# Altium project USB HUB.PrjPcb
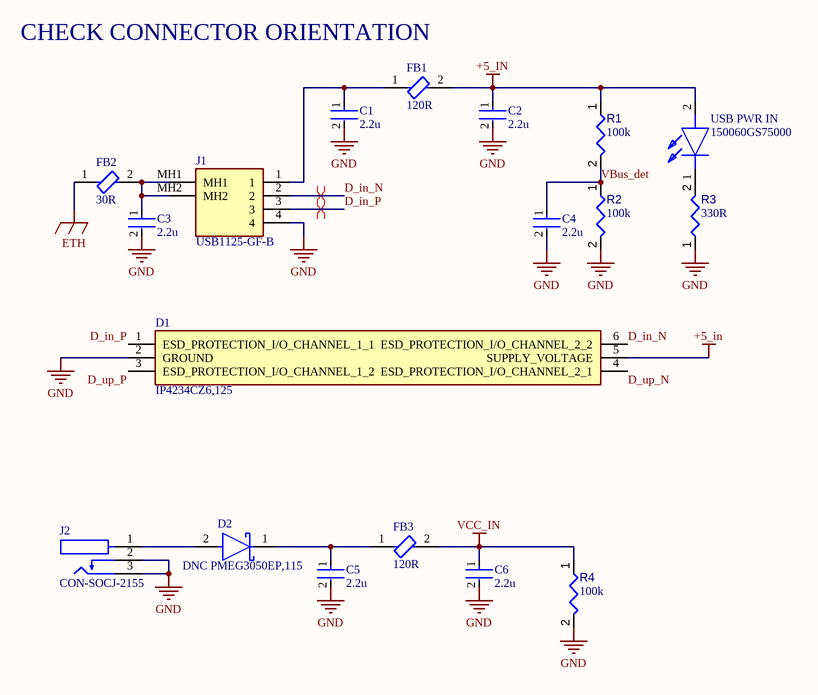
[diagram p0: Inputs.SchDoc]
4 sheets, 153 parts. Net scope: global (net labels, ports and power ports of the same name join across sheets).
Board file: USB_HUB.PcbDoc
Sheets:
  Inputs.SchDoc
  Power.SchDoc
  USB_HUB.SchDoc
  Outputs.SchDoc

## Sheet Inputs.SchDoc
size A4; SheetNumber: 1; SheetTotal: 4

### Parts
C1  Capacitance: 2.2u  [0603-C]  (hidden comment: 0603 CAP)
C2  Capacitance: 2.2u  [0603-C]  (hidden comment: 0603 CAP)
C3  Capacitance: 2.2u  [0603-C]  (hidden comment: 0603 CAP)
C4  Capacitance: 2.2u  [0603-C]  (hidden comment: 0603 CAP)
C5  Capacitance: 2.2u  [0603-C]  (hidden comment: 0603 CAP)
C6  Capacitance: 2.2u  [0603-C]  (hidden comment: 0603 CAP)
D1  IP4234CZ6,125  [SOP95P275X110-6N]
D2  DNC PMEG3050EP,115  [FP-SOD128-MFG]
FB1  120R  [FP-ILHB-0805-IPC_C]
FB2  30R  [FP-BLM18-0_15-t0_6-d1_2-MFG]
FB3  120R  [FP-ILHB-0805-IPC_C]
J1  USB1125-GF-B  [USB1125GFB]
J2  CON-SOCJ-2155  [GRAVITECH_CON-SOCJ-2155]
R1  value 100k  [0603-R]  (hidden comment: 0603 Resistor)
R2  value 100k  [0603-R]  (hidden comment: 0603 Resistor)
R3  value 330R  [0603-R]  (hidden comment: 0603 Resistor)
R4  value 100k  [0603-R]  (hidden comment: 0603 Resistor)
USB_PWR_IN  150060GS75000  [LEDC1608X80N]

### Nets
+5_in: C2.1 D1.5(SUPPLY_VOLTAGE) FB1.2 R1.1 USB_PWR_IN.2(A)
ETH: FB2.1
GND: C1.2 C2.2 C3.2 C4.2 C5.2 C6.2 D1.2(GROUND) J1.4 J2.2 J2.3 R2.2 R3.1 R4.2
VCC_IN: C6.1 FB3.2 R4.1
D_in_N: D1.6(ESD_PROTECTION_I/O_CHANNEL_2_2) J1.2
D_in_P: D1.1(ESD_PROTECTION_I/O_CHANNEL_1_1) J1.3
D_up_N: D1.4(ESD_PROTECTION_I/O_CHANNEL_2_1)
D_up_P: D1.3(ESD_PROTECTION_I/O_CHANNEL_1_2)
VBus_det: C4.1 R1.2 R2.1
NetC1_1: C1.1 FB1.1 J1.1
NetC3_1: C3.1 FB2.2 J1.MH1 J1.MH2
NetC5_1: C5.1 D2.1(C) FB3.1
NetD2_2: D2.2(A) J2.1
NetR3_2: R3.2 USB_PWR_IN.1(K)

### Layout directives
differential pair: D_in_N, D_in_P

### Notes on the sheet
- CHECK CONNECTOR ORIENTATION

### Library data of the parts
C1-C6 = CMP-2006-02792-2: Manufacturer: Murata; Manufacturer Part Number: GRM188R60J106ME47D; Voltage Rating (DC): 6.3V; Dielectric: X5R; Material: Ceramic; Tolerance: 20%; Packaging: Tape and Reel; Width: 0.031inch; Termination: SMD/SMT; Package Quantity: 4000; Voltage Rating: 6.3V; Case/Package: 0603; Min Operating Temperature: -55°C; Voltage: 6.3V; Length: 1.6mm; Thickness: 0.035inch; Lead Free: Lead Free; Depth: 0.8mm; Case Code (Imperial): 0603; Max Operating Temperature: 85°C; Height: 0.8mm; Mount: Surface Mount; REACH SVHC: No SVHC; Radiation Hardening: No; Case Code (Metric): 1608
D1 = IP4234CZ6,125: Diode; Manufacturer_Name: Nexperia; Datasheet Link: https://assets.nexperia.com/documents/data-sheet/IP4234CZ6.pdf; Height: 1.1mm; Manufacturer_Part_Number: IP4234CZ6,125; Mouser Part Number: 771-IP4234CZ6125; Mouser Price/Stock: https://www.mouser.co.uk/ProductDetail/Nexperia/IP4234CZ6125?qs=sSXnapcmqSskfgXn%2F9aKzA%3D%3D; Arrow Part Number: IP4234CZ6,125; Arrow Price/Stock: https://www.arrow.com/en/products/ip4234cz6125/nexperia?region=nac
D2 = CMP-14398-000051-1: DIODE SCHOTTKY 30V 5A SOD128; RoHS Compliant: Yes
FB1 FB3 = CMP-02428-000001-1: FERRITE BEAD 600 OHM 0805 1LN; Manufacturer: Vishay; Manufacturer Part Number: ILHB0805ER601V; Tolerance: 25%; Shielding: true; Test Frequency: 100MHz; Impedance At Frequency: 600Ω @ 100MHz; Series Resistance: 0.1Ω; Rms Current: 2000mA; ComponentLink2URL: http://www.vishay.com/docs/34102/ilhb.pdf; Octopart: https://octopart.com/ilhb0805er601v-vishay-39650184; Automotive: No; Height: 1.1mm; Mouser Description: Ferrite Beads Multi-Layer High Current 600Ohm 25% 100MHz 2A 100mOhm DCR 0805 T/R; ComponentLink2Description: Datasheet; Device Class L2: EMI / RFI Components; Lead Free: Yes; Ipc Land Pattern Name: CAPC200125X90; Package: ILHB-0805; Device Class L1: Passive Components; Digikey Description: FERRITE BEAD 600 OHM 0805 1LN; Category: FBead; Temperature Range High: +125°C; Temperature: -55°C to +125°C; RoHS: TRUE; Temperature Range Low: -55°C; Device Class L3: Ferrite Beads and Chips
FB2 = CMP-0686-00540-4: Chip Ferrite Bead Array, 0603, 30Ω @ 100MHz, 25%, 0.01Ω, 5A; Material: Steel; Number of Circuits: 1; DC Resistance (DCR): 10mR; Max Operating Temperature: 125°C; Max DC Current: 5A; Lead Free: Lead Free; Case Code (Imperial): 0603; RoHS Compliant: Yes; DC Current: 5A; Series: BLM18K; Number of Pins: 2; REACH SVHC: No SVHC; Case/Package: 0603; Military Standard: Not; Height: 0.8mm; Depth: 0.8mm; Core Material: Ferrite; Length: 1.6mm; Weight: 7.1E-05oz; Case Code (Metric): 1608; Impedance: 30R; Termination: SMD/SMT; Tolerance: 25%; Number of Lines: 1; Radiation Hardening: No; Packaging: Tape and Reel; Test Frequency: 100MHz; Current Rating: 5A; Package Quantity: 1; Width: 0.8mm; Max Current Rating: 5A; Min Operating Temperature: -55°C
J1 = USB1125-GF-B: Connector; Manufacturer_Name: GCT (GLOBAL CONNECTOR TECHNOLOGY); Datasheet Link: https://gct.co/connector/usb1125; Height: 6.63mm; Manufacturer_Part_Number: USB1125-GF-B; Mouser Part Number: 640-USB1125-GF-B; Mouser Price/Stock: https://www.mouser.co.uk/ProductDetail/GCT/USB1125-GF-B?qs=KUoIvG%2F9IlbMrLtAEIp0gA%3D%3D
J2 = CON-SOCJ-2155: DC Power Connectors Power Jack/Connector 2.1mm x 5.5mm; Price: None; Package: None; Availability: Unavailable; MP: CON-SOCJ-2155; Value: *
R1-R4 = CMP-009-00014-5: Manufacturer: Yageo; Manufacturer Part Number: RC0603FR-071KL; Manufacturer: Panasonic; Manufacturer Part Number: ERJ3EKF1001V; Manufacturer Part Number: RC0603FR-131KL; Voltage Rating: 50V; Power: 100mW; Tolerance: 1%; Mounting Technology: SM; Pins: 2; Case/Package: 0603; Min Operating Temperature: -55°C; RoHS Compliant: True; Max Operating Temperature: 155°C; Component Type: Resistors
USB_PWR_IN = 150060GS75000: LED; Manufacturer_Name: Wurth Elektronik; Datasheet Link: https://componentsearchengine.com/Datasheets/2/150060GS75000.pdf; Height: 0.8mm; Manufacturer_Part_Number: 150060GS75000; Mouser Part Number: 710-150060GS75000; Mouser Price/Stock: https://www.mouser.co.uk/ProductDetail/Wurth-Elektronik/150060GS75000?qs=LlUlMxKIyB0UYkq5lDO8nA%3D%3D

## Sheet Power.SchDoc
size A4 portrait; SheetNumber: 2; SheetTotal: 4
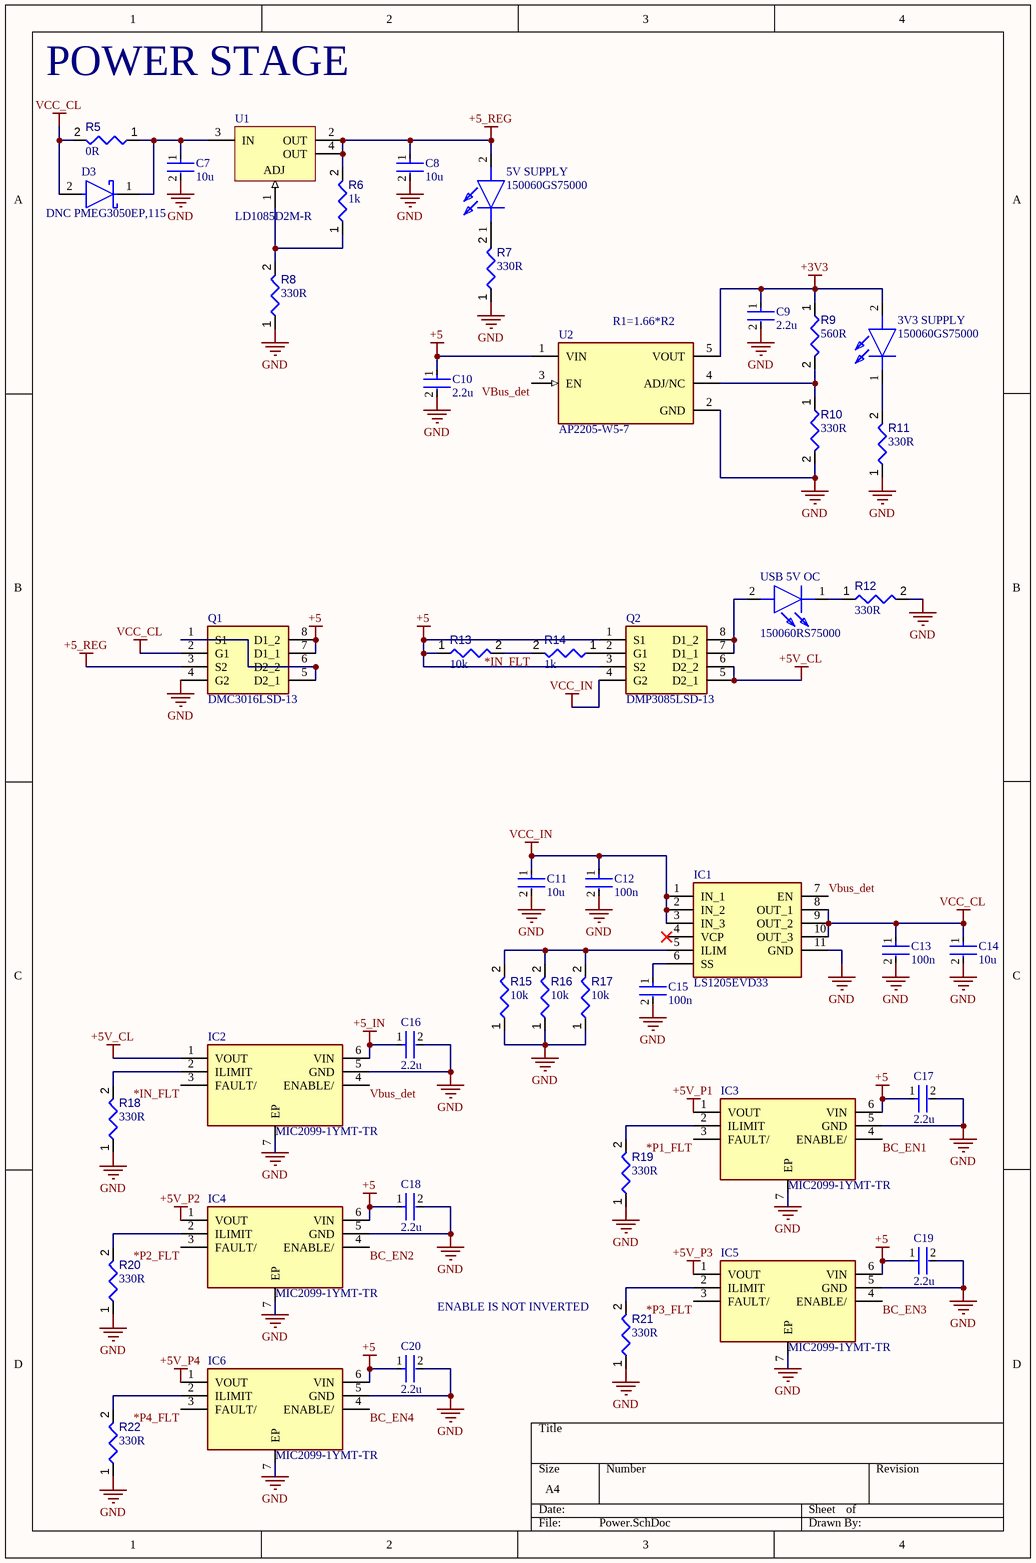
[diagram p1: Power.SchDoc]

### Parts
3V3_SUPPLY  150060GS75000  [LEDC1608X80N]
5V_SUPPLY  150060GS75000  [LEDC1608X80N]
C7  Capacitance: 10u  [1206-C]  (hidden comment: 1206 Capacitor)
C8  Capacitance: 10u  [1206-C]  (hidden comment: 1206 Capacitor)
C9  Capacitance: 2.2u  [0603-C]  (hidden comment: 0603 CAP)
C10  Capacitance: 2.2u  [0603-C]  (hidden comment: 0603 CAP)
C11  Capacitance: 10u  [1206-C]  (hidden comment: 1206 Capacitor)
C12  Capacitance: 100n  [0603-C]  (hidden comment: 0603 CAP)
C13  Capacitance: 100n  [0603-C]  (hidden comment: 0603 CAP)
C14  Capacitance: 10u  [1206-C]  (hidden comment: 1206 Capacitor)
C15  Capacitance: 100n  [0603-C]  (hidden comment: 0603 CAP)
C16  Capacitance: 2.2u  [0603-C]  (hidden comment: 0603 CAP)
C17  Capacitance: 2.2u  [0603-C]  (hidden comment: 0603 CAP)
C18  Capacitance: 2.2u  [0603-C]  (hidden comment: 0603 CAP)
C19  Capacitance: 2.2u  [0603-C]  (hidden comment: 0603 CAP)
C20  Capacitance: 2.2u  [0603-C]  (hidden comment: 0603 CAP)
D3  DNC PMEG3050EP,115  [FP-SOD128-MFG]
IC1  LS1205EVD33  [LS1205EVD33]
IC2  MIC2099-1YMT-TR  [SON50P160X160X60-7N-D]
IC3  MIC2099-1YMT-TR  [SON50P160X160X60-7N-D]
IC4  MIC2099-1YMT-TR  [SON50P160X160X60-7N-D]
IC5  MIC2099-1YMT-TR  [SON50P160X160X60-7N-D]
IC6  MIC2099-1YMT-TR  [SON50P160X160X60-7N-D]
Q1  DMC3016LSD-13  [SOIC127P600X175-8N]
Q2  DMP3085LSD-13  [SOIC127P600X175-8N]
R5  value 0R  [0603-R]  (hidden comment: 0603 Resistor)
R6  value 1k  [0603-R]  (hidden comment: 0603 Resistor)
R7  value 330R  [0603-R]  (hidden comment: 0603 Resistor)
R8  value 330R  [0603-R]  (hidden comment: 0603 Resistor)
R9  value 560R  [0603-R]  (hidden comment: 0603 Resistor)
R10  value 330R  [0603-R]  (hidden comment: 0603 Resistor)
R11  value 330R  [0603-R]  (hidden comment: 0603 Resistor)
R12  value 330R  [0603-R]  (hidden comment: 0603 Resistor)
R13  value 10k  [0603-R]  (hidden comment: 0603 Resistor)
R14  value 1k  [0603-R]  (hidden comment: 0603 Resistor)
R15  value 10k  [0603-R]  (hidden comment: 0603 Resistor)
R16  value 10k  [0603-R]  (hidden comment: 0603 Resistor)
R17  value 10k  [0603-R]  (hidden comment: 0603 Resistor)
R18  value 330R  [0603-R]  (hidden comment: 0603 Resistor)
R19  value 330R  [0603-R]  (hidden comment: 0603 Resistor)
R20  value 330R  [0603-R]  (hidden comment: 0603 Resistor)
R21  value 330R  [0603-R]  (hidden comment: 0603 Resistor)
R22  value 330R  [0603-R]  (hidden comment: 0603 Resistor)
U1  LD1085D2M-R  [D2PAK_A_L]
U2  AP2205-W5-7  [FP-SOT25-MFG]
USB_5V_OC  150060RS75000  [LEDC1608X80N]

### Nets
+3V3: 3V3_SUPPLY.2(A) C9.1 R9.1 U2.5(VOUT)
+5: C10.1 C17.1 C18.1 C19.1 C20.1 IC3.6(VIN) IC4.6(VIN) IC5.6(VIN) IC6.6(VIN) Q1.7(D1_1) Q1.8(D1_2) Q2.1(S1) Q2.3(S2) R13.1 U2.1(VIN)
+5_in: C16.1 IC2.6(VIN)
+5_REG: 5V_SUPPLY.2(A) C8.1 Q1.3(S2) R6.2 U1.2(OUT) U1.4(OUT)
+5V_CL: IC2.1(VOUT) Q2.5(D2_1) Q2.6(D2_2)
+5V_P1: IC3.1(VOUT)
+5V_P2: IC4.1(VOUT)
+5V_P3: IC5.1(VOUT)
+5V_P4: IC6.1(VOUT)
GND: C7.2 C8.2 C9.2 C10.2 C11.2 C12.2 C13.2 C14.2 C15.2 C16.2 C17.2 C18.2 C19.2 C20.2 IC1.11(GND) IC2.5(GND) IC2.7(EP) IC3.5(GND) IC3.7(EP) IC4.5(GND) IC4.7(EP) IC5.5(GND) IC5.7(EP) IC6.5(GND) IC6.7(EP) Q1.4(G2) R7.1 R8.1 R10.2 R11.1 R12.2 R15.1 R16.1 R17.1 R18.1 R19.1 R20.1 R21.1 R22.1 U2.2(GND)
VCC_CL: C13.1 C14.1 D3.2(A) IC1.8(OUT_1) IC1.9(OUT_2) IC1.10(OUT_3) Q1.2(G1) R5.2
VCC_IN: C11.1 C12.1 IC1.1(IN_1) IC1.2(IN_2) IC1.3(IN_3) Q2.4(G2)
*IN_FLT: IC2.3(FAULT/) R13.2 R14.2
*P1_FLT: IC3.3(FAULT/)
*P2_FLT: IC4.3(FAULT/)
*P3_FLT: IC5.3(FAULT/)
*P4_FLT: IC6.3(FAULT/)
BC_EN1: IC3.4(ENABLE/)
BC_EN2: IC4.4(ENABLE/)
BC_EN3: IC5.4(ENABLE/)
BC_EN4: IC6.4(ENABLE/)
VBus_det: IC1.7(EN) IC2.4(ENABLE/) U2.3(EN)
Net3V3_SUPPLY_1: 3V3_SUPPLY.1(K) R11.2
Net5V_SUPPLY_1: 5V_SUPPLY.1(K) R7.2
NetC7_1: C7.1 D3.1(C) R5.1 U1.3(IN)
NetC15_1: C15.1 IC1.6(SS)
NetIC1_5: IC1.5(ILIM) R15.2 R16.2 R17.2
NetIC2_2: IC2.2(ILIMIT) R18.2
NetIC3_2: IC3.2(ILIMIT) R19.2
NetIC4_2: IC4.2(ILIMIT) R20.2
NetIC5_2: IC5.2(ILIMIT) R21.2
NetIC6_2: IC6.2(ILIMIT) R22.2
NetQ1_1: Q1.1(S1) Q1.5(D2_1) Q1.6(D2_2)
NetQ2_2: Q2.2(G1) R14.1
NetQ2_7: Q2.7(D1_1) Q2.8(D1_2) USB_5V_OC.2(A)
NetR6_1: R6.1 R8.2 U1.1(ADJ)
NetR9_2: R9.2 R10.1 U2.4(ADJ/NC)
NetR12_1: R12.1 USB_5V_OC.1(K)

Not connected (* = marked no-connect by the designer): IC1 4(VCP)*

### Notes on the sheet
- POWER STAGE
- (near U2) R1=1.66*R2
- ENABLE IS NOT INVERTED

### Library data of the parts
3V3_SUPPLY 5V_SUPPLY = 150060GS75000: LED; Manufacturer_Name: Wurth Elektronik; Datasheet Link: https://componentsearchengine.com/Datasheets/2/150060GS75000.pdf; Height: 0.8mm; Manufacturer_Part_Number: 150060GS75000; Mouser Part Number: 710-150060GS75000; Mouser Price/Stock: https://www.mouser.co.uk/ProductDetail/Wurth-Elektronik/150060GS75000?qs=LlUlMxKIyB0UYkq5lDO8nA%3D%3D
C7 C8 C11 C14 = CMP-06035-003589-1: Manufacturer: Murata; Manufacturer Part Number: GRM31CR71E106KA12L; Voltage Rating (DC): 25V; Material: Ceramic; Tolerance: 10%; Dielectric: X7R; Case Code (Imperial): 1206; Voltage Rating: 25V; Length: 3.2mm; Lead Free: Lead Free; Thickness: 0.071inch; Package Quantity: 1; Width: 1.6mm; Max Operating Temperature: 125°C; Number of Pins: 2; Height: 1.6mm; Case Code (Metric): 3216; REACH SVHC: No SVHC; Radiation Hardening: No; Case/Package: 1206; Voltage: 25V; Mount: Surface Mount; Packaging: Tape and Reel; Termination: SMD/SMT; Min Operating Temperature: -55°C; Depth: 1.6mm
C9 C10 C12 C13 C15-C20 = CMP-2006-02792-2: as C1 on sheet Inputs; Packaging: Tape and Reel; Width: 0.031inch; Termination: SMD/SMT; Package Quantity: 4000; Voltage Rating: 6.3V; Case/Package: 0603; Min Operating Temperature: -55°C; Voltage: 6.3V; Length: 1.6mm; Thickness: 0.035inch; Lead Free: Lead Free; Depth: 0.8mm; Case Code (Imperial): 0603; Max Operating Temperature: 85°C; Height: 0.8mm; Mount: Surface Mount; REACH SVHC: No SVHC; Radiation Hardening: No; Case Code (Metric): 1608
D3 = CMP-14398-000051-1: DIODE SCHOTTKY 30V 5A SOD128; RoHS Compliant: Yes
IC1 = LS1205EVD33: Integrated Circuit; Manufacturer_Name: LITTELFUSE; Datasheet Link: https://www.littelfuse.com/media?resourcetype=datasheets&itemid=b40a8809-c1ad-459d-a34c-84532dbddcb7&filename=littelfuse-protection-ic-ls1205exd33--datasheet; Height: 0.8mm; Manufacturer_Part_Number: LS1205EVD33
IC2-IC6 = MIC2097-2YMT-TR: **EN is not inverted; Manufacturer_Name: Microchip; Datasheet Link: http://www.microchip.com/mymicrochip/filehandler.aspx?ddocname=en579484; Height: 0.6mm; Manufacturer_Part_Number: MIC2097-2YMT-TR; Mouser Part Number: 998-MIC2097-2YMTTR; Mouser Price/Stock: https://www.mouser.co.uk/ProductDetail/Microchip-Technology-Micrel/MIC2097-2YMT-TR?qs=Y3Q3JoKAO1STlVNIQyVOyQ%3D%3D
Q1 = DMC3016LSD-13: MOSFET (N&P-Channel); Manufacturer_Name: Diodes Inc.; Datasheet Link: https://www.diodes.com/assets/Datasheets/DMC3016LSD.pdf; Height: 1.75mm; Manufacturer_Part_Number: DMC3016LSD-13; Mouser Part Number: 621-DMC3016LSD-13; Mouser Price/Stock: https://www.mouser.co.uk/ProductDetail/Diodes-Incorporated/DMC3016LSD-13?qs=5V6w%252Be2aIqYl%2FV2fEzcwTA%3D%3D; Arrow Part Number: DMC3016LSD-13; Arrow Price/Stock: https://www.arrow.com/en/products/dmc3016lsd-13/diodes-incorporated
Q2 = DMP3085LSD-13: MOSFET (P-Channel); Manufacturer_Name: Diodes Inc.; Datasheet Link: https://www.diodes.com/assets/Datasheets/DMP3085LSD.pdf; Height: 1.75mm; Manufacturer_Part_Number: DMP3085LSD-13; Mouser Part Number: 621-DMP3085LSD-13; Mouser Price/Stock: https://www.mouser.co.uk/ProductDetail/Diodes-Incorporated/DMP3085LSD-13?qs=L1DZKBg7t5H5rh%252BaQZmdng%3D%3D; Arrow Part Number: DMP3085LSD-13; Arrow Price/Stock: https://www.arrow.com/en/products/dmp3085lsd-13/diodes-incorporated?region=nac
R5-R22 = CMP-009-00014-5: as R1 on sheet Inputs; Mounting Technology: SM; Pins: 2; Case/Package: 0603; Min Operating Temperature: -55°C; RoHS Compliant: True; Max Operating Temperature: 155°C; Component Type: Resistors
U1 = CMP-0244-00500-1: 3A, Low Drop Positive Voltage Regulator, Adjustable Vo, 4-Pin D2PAK/A; ComponentLink1Description: Manufacturer URL; PackageReference: D2PAK_A; ComponentLink1URL: http://www.st.com; ComponentLink2Description: Datasheet; ComponentLink2URL: http://www.st.com/internet/com/TECHNICAL_RESOURCES/TECHNICAL_LITERATURE/DATASHEET/CD00001883.pdf; PackageVersion: 2011; DatasheetVersion: 28/07/2009; PackageDescription: 4-Pin Transistor Outline Package 2.54 mm Pitch, 15.4 mm Lead Span
U2 = CMP-12756-000046-1: IC REG LIN POS ADJ 250MA SOT25
USB_5V_OC = 150060RS75000: LED; Manufacturer_Name: Wurth Elektronik; Datasheet Link: http://katalog.we-online.de/led/datasheet/150060RS75000.pdf; Height: 0.8mm; Manufacturer_Part_Number: 150060RS75000; Mouser Part Number: 710-150060RS75000; Mouser Price/Stock: https://www.mouser.co.uk/ProductDetail/Wurth-Elektronik/150060RS75000?qs=LlUlMxKIyB3QnmZ3fw%2FVCA%3D%3D

## Sheet USB_HUB.SchDoc
size A4; SheetNumber: 3; SheetTotal: 3
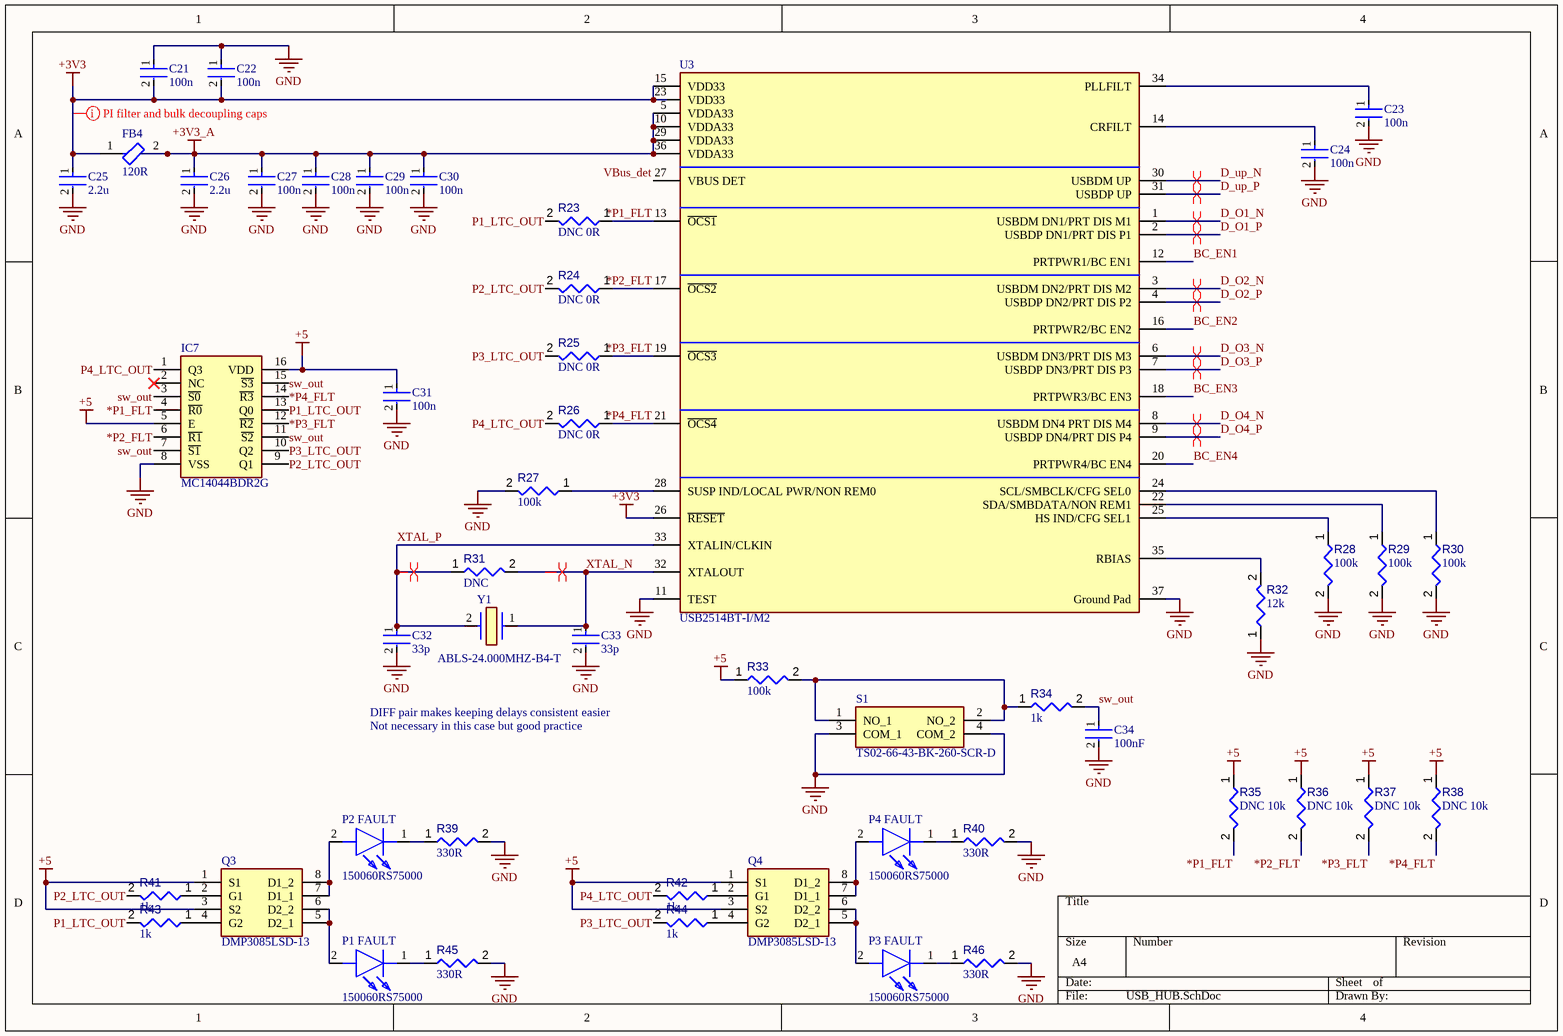
[diagram p2: USB_HUB.SchDoc]

### Parts
C21  Capacitance: 100n  [0603-C]  (hidden comment: 0603 CAP)
C22  Capacitance: 100n  [0603-C]  (hidden comment: 0603 CAP)
C23  Capacitance: 100n  [0603-C]  (hidden comment: 0603 CAP)
C24  Capacitance: 100n  [0603-C]  (hidden comment: 0603 CAP)
C25  Capacitance: 2.2u  [0603-C]  (hidden comment: 0603 CAP)
C26  Capacitance: 2.2u  [0603-C]  (hidden comment: 0603 CAP)
C27  Capacitance: 100n  [0603-C]  (hidden comment: 0603 CAP)
C28  Capacitance: 100n  [0603-C]  (hidden comment: 0603 CAP)
C29  Capacitance: 100n  [0603-C]  (hidden comment: 0603 CAP)
C30  Capacitance: 100n  [0603-C]  (hidden comment: 0603 CAP)
C31  Capacitance: 100n  [0603-C]  (hidden comment: 0603 CAP)
C32  Capacitance: 33p  [0603-C]  (hidden comment: 0603 CAP)
C33  Capacitance: 33p  [0603-C]  (hidden comment: 0603 CAP)
C34  100nF  [FP-GRM188-0_1-e0_2_0_55-IPC_A]
FB4  120R  [FP-ILHB-0805-IPC_C]
IC7  MC14044BDR2G  [SOIC127P600X175-16N]
P1_FAULT  150060RS75000  [LEDC1608X80N]
P2_FAULT  150060RS75000  [LEDC1608X80N]
P3_FAULT  150060RS75000  [LEDC1608X80N]
P4_FAULT  150060RS75000  [LEDC1608X80N]
Q3  DMP3085LSD-13  [SOIC127P600X175-8N]
Q4  DMP3085LSD-13  [SOIC127P600X175-8N]
R23  value DNC 0R  [0603-R]  (hidden comment: 0603 Resistor)
R24  value DNC 0R  [0603-R]  (hidden comment: 0603 Resistor)
R25  value DNC 0R  [0603-R]  (hidden comment: 0603 Resistor)
R26  value DNC 0R  [0603-R]  (hidden comment: 0603 Resistor)
R27  value 100k  [0603-R]  (hidden comment: 0603 Resistor)
R28  value 100k  [0603-R]  (hidden comment: 0603 Resistor)
R29  value 100k  [0603-R]  (hidden comment: 0603 Resistor)
R30  value 100k  [0603-R]  (hidden comment: 0603 Resistor)
R31  value DNC  [0603-R]  (hidden comment: 0603 Resistor)
R32  value 12k  [0603-R]  (hidden comment: 0603 Resistor)
R33  value 100k  [0603-R]  (hidden comment: 0603 Resistor)
R34  value 1k  [0603-R]  (hidden comment: 0603 Resistor)
R35  value DNC 10k  [0603-R]  (hidden comment: 0603 Resistor)
R36  value DNC 10k  [0603-R]  (hidden comment: 0603 Resistor)
R37  value DNC 10k  [0603-R]  (hidden comment: 0603 Resistor)
R38  value DNC 10k  [0603-R]  (hidden comment: 0603 Resistor)
R39  value 330R  [0603-R]  (hidden comment: 0603 Resistor)
R40  value 330R  [0603-R]  (hidden comment: 0603 Resistor)
R41  value 1k  [0603-R]  (hidden comment: 0603 Resistor)
R42  value 1k  [0603-R]  (hidden comment: 0603 Resistor)
R43  value 1k  [0603-R]  (hidden comment: 0603 Resistor)
R44  value 1k  [0603-R]  (hidden comment: 0603 Resistor)
R45  value 330R  [0603-R]  (hidden comment: 0603 Resistor)
R46  value 330R  [0603-R]  (hidden comment: 0603 Resistor)
S1  TS02-66-43-BK-260-SCR-D  [TS026643BK260SCRD]
U3  USB2514BT-I/M2  [FP-36SQFN-3706-6x6B-MFG]
Y1  ABLS-24.000MHZ-B4-T  [ABLS24000MHZB4T]

### Nets
+3V3: C21.2 C22.2 C25.1 FB4.1 U3.15(VDD33) U3.23(VDD33) U3.26(~{RESET})
+3V3_A: C26.1 C27.1 C28.1 C29.1 C30.1 FB4.2 U3.5(VDDA33) U3.10(VDDA33) U3.29(VDDA33) U3.36(VDDA33)
+5: C31.1 IC7.5(E) IC7.16(VDD) Q3.1(S1) Q3.3(S2) Q4.1(S1) Q4.3(S2) R33.1 R35.1 R36.1 R37.1 R38.1
GND: C21.1 C22.1 C23.2 C24.2 C25.2 C26.2 C27.2 C28.2 C29.2 C30.2 C31.2 C32.2 C33.2 C34.2 IC7.8(VSS) R27.2 R28.2 R29.2 R30.2 R32.1 R39.2 R40.2 R45.2 R46.2 S1.3(COM_1) S1.4(COM_2) U3.11(TEST) U3.37(Ground_Pad)
*P1_FLT: IC7.4(~{R0}) R23.1 R35.2 U3.13(~{OCS1})
*P2_FLT: IC7.6(~{R1}) R24.1 R36.2 U3.17(~{OCS2})
*P3_FLT: IC7.12(~{R2}) R25.1 R37.2 U3.19(~{OCS3})
*P4_FLT: IC7.14(~{R3}) R26.1 R38.2 U3.21(~{OCS4})
BC_EN1: U3.12(PRTPWR1/BC_EN1)
BC_EN2: U3.16(PRTPWR2/BC_EN2)
BC_EN3: U3.18(PRTPWR3/BC_EN3)
BC_EN4: U3.20(PRTPWR4/BC_EN4)
D_O1_N: U3.1(USBDM_DN1/PRT_DIS_M1)
D_O1_P: U3.2(USBDP_DN1/PRT_DIS_P1)
D_O2_N: U3.3(USBDM_DN2/PRT_DIS_M2)
D_O2_P: U3.4(USBDP_DN2/PRT_DIS_P2)
D_O3_N: U3.6(USBDM_DN3/PRT_DIS_M3)
D_O3_P: U3.7(USBDP_DN3/PRT_DIS_P3)
D_O4_N: U3.8(USBDM_DN4_PRT_DIS_M4)
D_O4_P: U3.9(USBDP_DN4/PRT_DIS_P4)
D_up_N: U3.30(USBDM_UP)
D_up_P: U3.31(USBDP_UP)
P1_LTC_OUT: IC7.13(Q0) R23.2 R43.2
P2_LTC_OUT: IC7.9(Q1) R24.2 R41.2
P3_LTC_OUT: IC7.10(Q2) R25.2 R44.2
P4_LTC_OUT: IC7.1(Q3) R26.2 R42.2
sw_out: C34.1 IC7.3(~{S0}) IC7.7(~{S1}) IC7.11(~{S2}) IC7.15(~{S3}) R34.2
VBus_det: U3.27(VBUS_DET)
XTAL_N: C33.1 R31.2 U3.32(XTALOUT) Y1.1(CRYSTAL_1)
XTAL_P: C32.1 R31.1 U3.33(XTALIN/CLKIN) Y1.2(CRYSTAL_2)
NetC23_1: C23.1 U3.34(PLLFILT)
NetC24_1: C24.1 U3.14(CRFILT)
NetP1_FAULT_1: P1_FAULT.1(K) R45.1
NetP1_FAULT_2: P1_FAULT.2(A) Q3.5(D2_1) Q3.6(D2_2)
NetP2_FAULT_1: P2_FAULT.1(K) R39.1
NetP2_FAULT_2: P2_FAULT.2(A) Q3.7(D1_1) Q3.8(D1_2)
NetP3_FAULT_1: P3_FAULT.1(K) R46.1
NetP3_FAULT_2: P3_FAULT.2(A) Q4.5(D2_1) Q4.6(D2_2)
NetP4_FAULT_1: P4_FAULT.1(K) R40.1
NetP4_FAULT_2: P4_FAULT.2(A) Q4.7(D1_1) Q4.8(D1_2)
NetQ3_2: Q3.2(G1) R41.1
NetQ3_4: Q3.4(G2) R43.1
NetQ4_2: Q4.2(G1) R42.1
NetQ4_4: Q4.4(G2) R44.1
NetR27_1: R27.1 U3.28(SUSP_IND/LOCAL_PWR/NON_REM0)
NetR28_1: R28.1 U3.25(HS_IND/CFG_SEL1)
NetR29_1: R29.1 U3.22(SDA/SMBDATA/NON_REM1)
NetR30_1: R30.1 U3.24(SCL/SMBCLK/CFG_SEL0)
NetR32_2: R32.2 U3.35(RBIAS)
NetR33_2: R33.2 R34.1 S1.1(NO_1) S1.2(NO_2)

Not connected (* = marked no-connect by the designer): IC7 2(NC)*

### Layout directives
differential pair: D_O1_N, D_O1_P, D_O2_N, D_O2_P, D_O3_N, D_O3_P, D_O4_N, D_O4_P, D_up_N, D_up_P, XTAL_N, XTAL_P
mark named PI filter and bulk decoupling caps: +3V3

### Notes on the sheet
- DIFF pair makes keeping delays consistent easier
- Not necessary in this case but good practice

### Library data of the parts
C21-C33 = CMP-2006-02792-2: as C1 on sheet Inputs; Packaging: Tape and Reel; Width: 0.031inch; Termination: SMD/SMT; Package Quantity: 4000; Voltage Rating: 6.3V; Case/Package: 0603; Min Operating Temperature: -55°C; Voltage: 6.3V; Length: 1.6mm; Thickness: 0.035inch; Lead Free: Lead Free; Depth: 0.8mm; Case Code (Imperial): 0603; Max Operating Temperature: 85°C; Height: 0.8mm; Mount: Surface Mount; REACH SVHC: No SVHC; Radiation Hardening: No; Case Code (Metric): 1608
C34 = CMP-2006-02792-2: Chip Multilayer Ceramic Capacitors for General Purpose, 0603, 10uF, X5R, 15%, 20%, 6.3V; Packaging: Tape and Reel; Voltage Rating (DC): 6.3V; Width: 0.031inch; Termination: SMD/SMT; Dielectric: X5R; Package Quantity: 4000; Voltage Rating: 6.3V; Capacitance: 10uF; Case/Package: 0603; Min Operating Temperature: -55°C; Voltage: 6.3V; Length: 1.6mm; Thickness: 0.035inch; Lead Free: Lead Free; Depth: 0.8mm; Case Code (Imperial): 0603; Max Operating Temperature: 85°C; Material: Ceramic; Height: 0.8mm; Tolerance: 20%; Mount: Surface Mount; REACH SVHC: No SVHC; Radiation Hardening: No; Case Code (Metric): 1608
FB4 = CMP-02428-000001-1: as FB1 on sheet Inputs; ComponentLink2URL: http://www.vishay.com/docs/34102/ilhb.pdf; Octopart: https://octopart.com/ilhb0805er601v-vishay-39650184; Automotive: No; Height: 1.1mm; Mouser Description: Ferrite Beads Multi-Layer High Current 600Ohm 25% 100MHz 2A 100mOhm DCR 0805 T/R; ComponentLink2Description: Datasheet; Device Class L2: EMI / RFI Components; Lead Free: Yes; Ipc Land Pattern Name: CAPC200125X90; Package: ILHB-0805; Device Class L1: Passive Components; Digikey Description: FERRITE BEAD 600 OHM 0805 1LN; Category: FBead; Temperature Range High: +125°C; Temperature: -55°C to +125°C; RoHS: TRUE; Temperature Range Low: -55°C; Device Class L3: Ferrite Beads and Chips
IC7 = MC14044BDR2G: Integrated Circuit; Manufacturer_Name: onsemi; Datasheet Link: http://www.onsemi.com/pub/Collateral/MC14043B-D.PDF; Height: 1.75mm; Manufacturer_Part_Number: MC14044BDR2G; Mouser Part Number: 863-MC14044BDR2G; Mouser Price/Stock: https://www.mouser.co.uk/ProductDetail/onsemi/MC14044BDR2G?qs=g2rIOKKlpobsE42k0bnUHA%3D%3D; Arrow Part Number: MC14044BDR2G; Arrow Price/Stock: http://www.arrow.com/en/products/mc14044bdr2g/on-semiconductor
P1_FAULT P2_FAULT P3_FAULT P4_FAULT = 150060RS75000: LED; Manufacturer_Name: Wurth Elektronik; Datasheet Link: http://katalog.we-online.de/led/datasheet/150060RS75000.pdf; Height: 0.8mm; Manufacturer_Part_Number: 150060RS75000; Mouser Part Number: 710-150060RS75000; Mouser Price/Stock: https://www.mouser.co.uk/ProductDetail/Wurth-Elektronik/150060RS75000?qs=LlUlMxKIyB3QnmZ3fw%2FVCA%3D%3D
Q3 Q4 = DMP3085LSD-13: as Q2 on sheet Power; Datasheet Link: https://www.diodes.com/assets/Datasheets/DMP3085LSD.pdf; Height: 1.75mm; Manufacturer_Part_Number: DMP3085LSD-13; Mouser Part Number: 621-DMP3085LSD-13; Mouser Price/Stock: https://www.mouser.co.uk/ProductDetail/Diodes-Incorporated/DMP3085LSD-13?qs=L1DZKBg7t5H5rh%252BaQZmdng%3D%3D; Arrow Part Number: DMP3085LSD-13; Arrow Price/Stock: https://www.arrow.com/en/products/dmp3085lsd-13/diodes-incorporated?region=nac
R23-R31 R33-R46 = CMP-009-00014-5: as R1 on sheet Inputs; Mounting Technology: SM; Pins: 2; Case/Package: 0603; Min Operating Temperature: -55°C; RoHS Compliant: True; Max Operating Temperature: 155°C; Component Type: Resistors
R32 = CMP-009-00014-5: 0603 Resistor +-1%; Manufacturer: Yageo; Manufacturer Part Number: RC0603FR-071KL; Manufacturer: Panasonic; Manufacturer Part Number: ERJ3EKF1001V; Manufacturer Part Number: RC0603FR-131KL; Voltage Rating: 50V; Power: 100mW; Tolerance: 1%; Mounting Technology: SM; Pins: 2; Case/Package: 0603; Min Operating Temperature: -55°C; RoHS Compliant: True; Max Operating Temperature: 155°C; Component Type: Resistors
S1 = TS02-66-43-BK-260-SCR-D: Switch; Manufacturer_Name: CUI Inc.; Datasheet Link: https://www.arrow.com/en/products/ts02-66-43-bk-260-scr-d/cui-devices?region=nac; Height: 4.5mm; Manufacturer_Part_Number: TS02-66-43-BK-260-SCR-D; Mouser Part Number: 179-TS026643BK260SCR; Mouser Price/Stock: https://www.mouser.co.uk/ProductDetail/CUI-Devices/TS02-66-43-BK-260-SCR-D?qs=A6eO%252BMLsxmStfetPfb1PWw%3D%3D; Arrow Part Number: TS02-66-43-BK-260-SCR-D; Arrow Price/Stock: https://www.arrow.com/en/products/ts02-66-43-bk-260-scr-d/cui-devices?region=nac
U3 = CMP-06284-000022-1: IC HUB CTLR 4PORT USB 2.0 HS 36S; Operating Supply Current: 70mA; Lead Free: Lead Free; Packaging: Tape and Reel; Interface: USB; Number of Pins: 36; Min Operating Temperature: -40°C; Max Operating Temperature: 85°C; RoHS Compliant: Yes
Y1 = ABLS-24.000MHZ-B4-T: Crystal or Oscillator; Manufacturer_Name: ABRACON; Datasheet Link: https://abracon.com/Support/PackageDrawing/Resonators/ABLS-2D.pdf; Height: 4.2mm; Manufacturer_Part_Number: ABLS-24.000MHZ-B4-T; Mouser Part Number: 815-ABLS-24.0M-T; Mouser Price/Stock: https://www.mouser.co.uk/ProductDetail/ABRACON/ABLS-24000MHZ-B4-T?qs=yTU0IcKoRlFmg5ISZhZAjw%3D%3D; Arrow Part Number: ABLS-24.000MHZ-B4-T; Arrow Price/Stock: https://www.arrow.com/en/products/abls-24.000mhz-b4-t/abracon

## Sheet Outputs.SchDoc
size A4 portrait; SheetNumber: 4; SheetTotal: 3
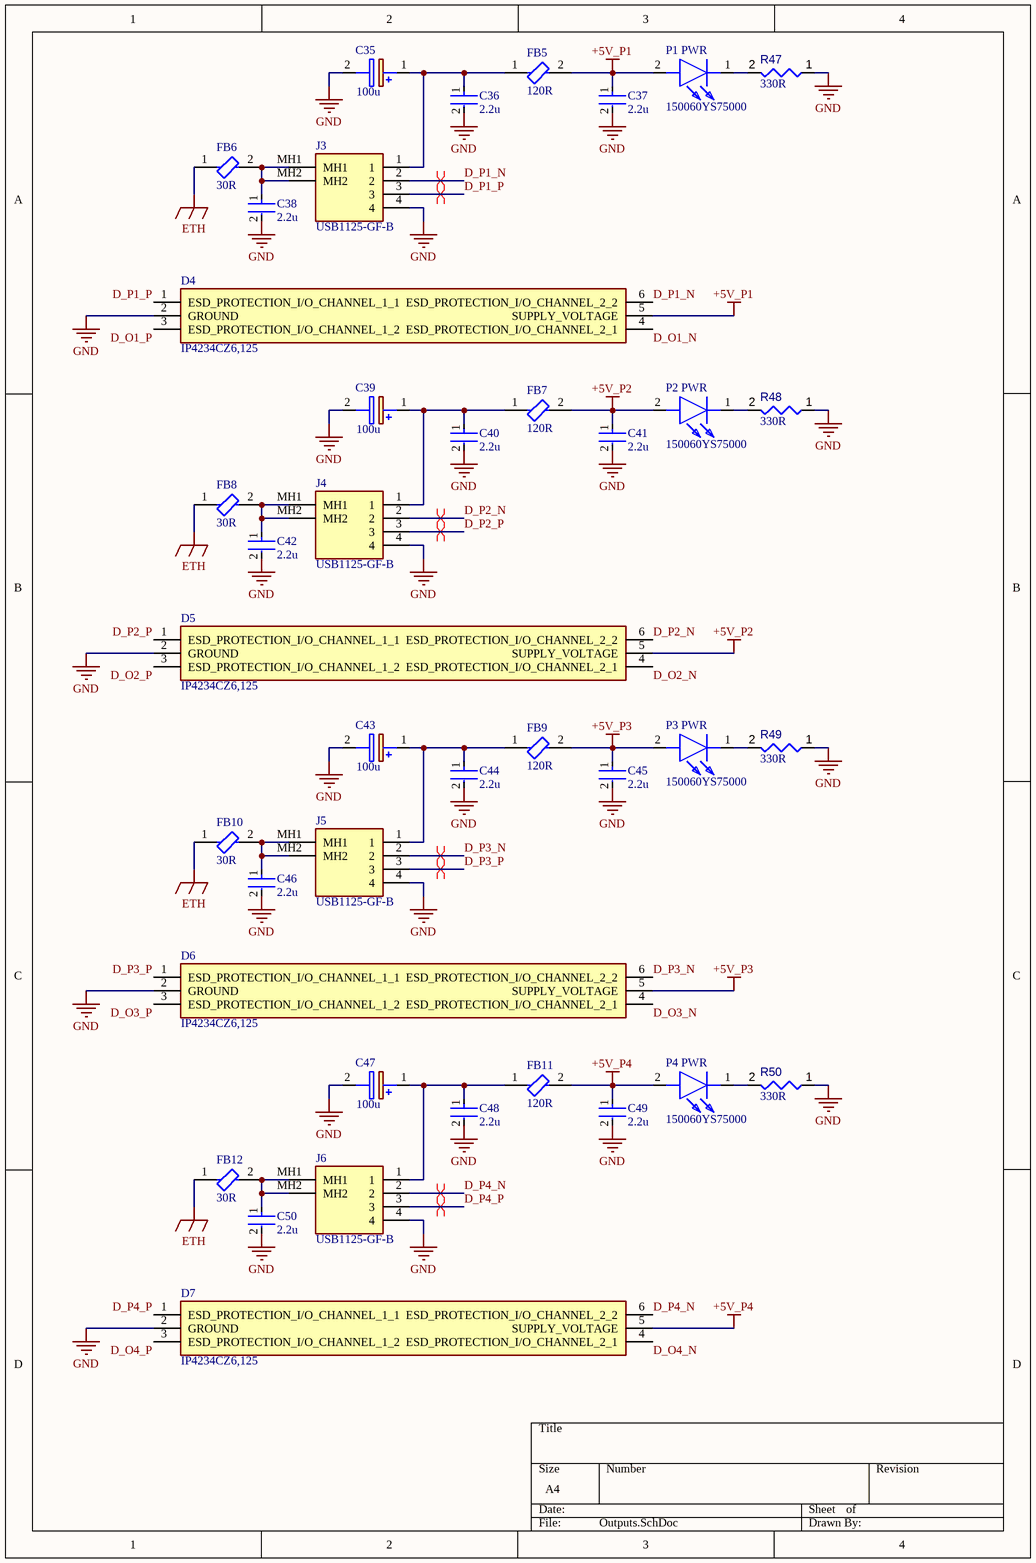
[diagram p3: Outputs.SchDoc]

### Parts
C35  value 100u  [CAPPM7343X310N]  (hidden comment: 293D107X0016D2TE3)
C36  Capacitance: 2.2u  [0603-C]  (hidden comment: 0603 CAP)
C37  Capacitance: 2.2u  [0603-C]  (hidden comment: 0603 CAP)
C38  Capacitance: 2.2u  [0603-C]  (hidden comment: 0603 CAP)
C39  value 100u  [CAPPM7343X310N]  (hidden comment: 293D107X0016D2TE3)
C40  Capacitance: 2.2u  [0603-C]  (hidden comment: 0603 CAP)
C41  Capacitance: 2.2u  [0603-C]  (hidden comment: 0603 CAP)
C42  Capacitance: 2.2u  [0603-C]  (hidden comment: 0603 CAP)
C43  value 100u  [CAPPM7343X310N]  (hidden comment: 293D107X0016D2TE3)
C44  Capacitance: 2.2u  [0603-C]  (hidden comment: 0603 CAP)
C45  Capacitance: 2.2u  [0603-C]  (hidden comment: 0603 CAP)
C46  Capacitance: 2.2u  [0603-C]  (hidden comment: 0603 CAP)
C47  value 100u  [CAPPM7343X310N]  (hidden comment: 293D107X0016D2TE3)
C48  Capacitance: 2.2u  [0603-C]  (hidden comment: 0603 CAP)
C49  Capacitance: 2.2u  [0603-C]  (hidden comment: 0603 CAP)
C50  Capacitance: 2.2u  [0603-C]  (hidden comment: 0603 CAP)
D4  IP4234CZ6,125  [SOP95P275X110-6N]
D5  IP4234CZ6,125  [SOP95P275X110-6N]
D6  IP4234CZ6,125  [SOP95P275X110-6N]
D7  IP4234CZ6,125  [SOP95P275X110-6N]
FB5  120R  [FP-ILHB-0805-IPC_C]
FB6  30R  [FP-BLM18-0_15-t0_6-d1_2-MFG]
FB7  120R  [FP-ILHB-0805-IPC_C]
FB8  30R  [FP-BLM18-0_15-t0_6-d1_2-MFG]
FB9  120R  [FP-ILHB-0805-IPC_C]
FB10  30R  [FP-BLM18-0_15-t0_6-d1_2-MFG]
FB11  120R  [FP-ILHB-0805-IPC_C]
FB12  30R  [FP-BLM18-0_15-t0_6-d1_2-MFG]
J3  USB1125-GF-B  [USB1125GFB]
J4  USB1125-GF-B  [USB1125GFB]
J5  USB1125-GF-B  [USB1125GFB]
J6  USB1125-GF-B  [USB1125GFB]
P1_PWR  150060YS75000  [LEDC1608X80N]
P2_PWR  150060YS75000  [LEDC1608X80N]
P3_PWR  150060YS75000  [LEDC1608X80N]
P4_PWR  150060YS75000  [LEDC1608X80N]
R47  value 330R  [0603-R]  (hidden comment: 0603 Resistor)
R48  value 330R  [0603-R]  (hidden comment: 0603 Resistor)
R49  value 330R  [0603-R]  (hidden comment: 0603 Resistor)
R50  value 330R  [0603-R]  (hidden comment: 0603 Resistor)

### Nets
+5V_P1: C37.1 D4.5(SUPPLY_VOLTAGE) FB5.2 P1_PWR.2(A)
+5V_P2: C41.1 D5.5(SUPPLY_VOLTAGE) FB7.2 P2_PWR.2(A)
+5V_P3: C45.1 D6.5(SUPPLY_VOLTAGE) FB9.2 P3_PWR.2(A)
+5V_P4: C49.1 D7.5(SUPPLY_VOLTAGE) FB11.2 P4_PWR.2(A)
ETH: FB6.1 FB8.1 FB10.1 FB12.1
GND: C35.2(-) C36.2 C37.2 C38.2 C39.2(-) C40.2 C41.2 C42.2 C43.2(-) C44.2 C45.2 C46.2 C47.2(-) C48.2 C49.2 C50.2 D4.2(GROUND) D5.2(GROUND) D6.2(GROUND) D7.2(GROUND) J3.4 J4.4 J5.4 J6.4 R47.1 R48.1 R49.1 R50.1
D_O1_N: D4.4(ESD_PROTECTION_I/O_CHANNEL_2_1)
D_O1_P: D4.3(ESD_PROTECTION_I/O_CHANNEL_1_2)
D_O2_N: D5.4(ESD_PROTECTION_I/O_CHANNEL_2_1)
D_O2_P: D5.3(ESD_PROTECTION_I/O_CHANNEL_1_2)
D_O3_N: D6.4(ESD_PROTECTION_I/O_CHANNEL_2_1)
D_O3_P: D6.3(ESD_PROTECTION_I/O_CHANNEL_1_2)
D_O4_N: D7.4(ESD_PROTECTION_I/O_CHANNEL_2_1)
D_O4_P: D7.3(ESD_PROTECTION_I/O_CHANNEL_1_2)
D_P1_N: D4.6(ESD_PROTECTION_I/O_CHANNEL_2_2) J3.2
D_P1_P: D4.1(ESD_PROTECTION_I/O_CHANNEL_1_1) J3.3
D_P2_N: D5.6(ESD_PROTECTION_I/O_CHANNEL_2_2) J4.2
D_P2_P: D5.1(ESD_PROTECTION_I/O_CHANNEL_1_1) J4.3
D_P3_N: D6.6(ESD_PROTECTION_I/O_CHANNEL_2_2) J5.2
D_P3_P: D6.1(ESD_PROTECTION_I/O_CHANNEL_1_1) J5.3
D_P4_N: D7.6(ESD_PROTECTION_I/O_CHANNEL_2_2) J6.2
D_P4_P: D7.1(ESD_PROTECTION_I/O_CHANNEL_1_1) J6.3
NetC35_1: C35.1(+) C36.1 FB5.1 J3.1
NetC38_1: C38.1 FB6.2 J3.MH1 J3.MH2
NetC39_1: C39.1(+) C40.1 FB7.1 J4.1
NetC42_1: C42.1 FB8.2 J4.MH1 J4.MH2
NetC43_1: C43.1(+) C44.1 FB9.1 J5.1
NetC46_1: C46.1 FB10.2 J5.MH1 J5.MH2
NetC47_1: C47.1(+) C48.1 FB11.1 J6.1
NetC50_1: C50.1 FB12.2 J6.MH1 J6.MH2
NetP1_PWR_1: P1_PWR.1(K) R47.2
NetP2_PWR_1: P2_PWR.1(K) R48.2
NetP3_PWR_1: P3_PWR.1(K) R49.2
NetP4_PWR_1: P4_PWR.1(K) R50.2

### Layout directives
differential pair: D_P1_N, D_P1_P, D_P2_N, D_P2_P, D_P3_N, D_P3_P, D_P4_N, D_P4_P

### Library data of the parts
C35 C39 C43 C47 = 293D107X0016D2TE3: Capacitor Polarised; Manufacturer_Name: Vishay; Datasheet Link: http://www.vishay.com/doc?40002; Height: 3.1mm; Manufacturer_Part_Number: 293D107X0016D2TE3; Mouser Part Number: 74-293D107X0016D2TE3; Mouser Price/Stock: https://www.mouser.com/Search/Refine.aspx?Keyword=74-293D107X0016D2TE3; Arrow Part Number: 293D107X0016D2TE3; Arrow Price/Stock: https://www.arrow.com/en/products/293d107x0016d2te3/vishay
C36-C38 C40-C42 C44-C46 C48-C50 = CMP-2006-02792-2: as C1 on sheet Inputs; Packaging: Tape and Reel; Width: 0.031inch; Termination: SMD/SMT; Package Quantity: 4000; Voltage Rating: 6.3V; Case/Package: 0603; Min Operating Temperature: -55°C; Voltage: 6.3V; Length: 1.6mm; Thickness: 0.035inch; Lead Free: Lead Free; Depth: 0.8mm; Case Code (Imperial): 0603; Max Operating Temperature: 85°C; Height: 0.8mm; Mount: Surface Mount; REACH SVHC: No SVHC; Radiation Hardening: No; Case Code (Metric): 1608
D4-D7 = IP4234CZ6,125: Diode; Manufacturer_Name: Nexperia; Datasheet Link: https://assets.nexperia.com/documents/data-sheet/IP4234CZ6.pdf; Height: 1.1mm; Manufacturer_Part_Number: IP4234CZ6,125; Mouser Part Number: 771-IP4234CZ6125; Mouser Price/Stock: https://www.mouser.co.uk/ProductDetail/Nexperia/IP4234CZ6125?qs=sSXnapcmqSskfgXn%2F9aKzA%3D%3D; Arrow Part Number: IP4234CZ6,125; Arrow Price/Stock: https://www.arrow.com/en/products/ip4234cz6125/nexperia?region=nac
FB5 FB7 FB9 FB11 = CMP-02428-000001-1: as FB1 on sheet Inputs; ComponentLink2URL: http://www.vishay.com/docs/34102/ilhb.pdf; Octopart: https://octopart.com/ilhb0805er601v-vishay-39650184; Automotive: No; Height: 1.1mm; Mouser Description: Ferrite Beads Multi-Layer High Current 600Ohm 25% 100MHz 2A 100mOhm DCR 0805 T/R; ComponentLink2Description: Datasheet; Device Class L2: EMI / RFI Components; Lead Free: Yes; Ipc Land Pattern Name: CAPC200125X90; Package: ILHB-0805; Device Class L1: Passive Components; Digikey Description: FERRITE BEAD 600 OHM 0805 1LN; Category: FBead; Temperature Range High: +125°C; Temperature: -55°C to +125°C; RoHS: TRUE; Temperature Range Low: -55°C; Device Class L3: Ferrite Beads and Chips
FB6 FB8 FB10 FB12 = CMP-0686-00540-4: as FB2 on sheet Inputs; Max Operating Temperature: 125°C; Max DC Current: 5A; Lead Free: Lead Free; Case Code (Imperial): 0603; RoHS Compliant: Yes; DC Current: 5A; Series: BLM18K; Number of Pins: 2; REACH SVHC: No SVHC; Case/Package: 0603; Military Standard: Not; Height: 0.8mm; Depth: 0.8mm; Core Material: Ferrite; Length: 1.6mm; Weight: 7.1E-05oz; Case Code (Metric): 1608; Impedance: 30R; Termination: SMD/SMT; Tolerance: 25%; Number of Lines: 1; Radiation Hardening: No; Packaging: Tape and Reel; Test Frequency: 100MHz; Current Rating: 5A; Package Quantity: 1; Width: 0.8mm; Max Current Rating: 5A; Min Operating Temperature: -55°C
J3-J6 = USB1125-GF-B: as J1 on sheet Inputs; Datasheet Link: https://gct.co/connector/usb1125; Height: 6.63mm; Manufacturer_Part_Number: USB1125-GF-B; Mouser Part Number: 640-USB1125-GF-B; Mouser Price/Stock: https://www.mouser.co.uk/ProductDetail/GCT/USB1125-GF-B?qs=KUoIvG%2F9IlbMrLtAEIp0gA%3D%3D
P1_PWR P2_PWR P3_PWR P4_PWR = 150060YS75000: LED; Manufacturer_Name: Wurth Elektronik; Datasheet Link: http://uk.rs-online.com/web/p/products/8154219; Height: 0.8mm; Manufacturer_Part_Number: 150060YS75000; Mouser Part Number: 710-150060YS75000; Mouser Price/Stock: https://www.mouser.co.uk/ProductDetail/Wurth-Elektronik/150060YS75000?qs=LlUlMxKIyB0nKmwefHgtZw%3D%3D
R47-R50 = CMP-009-00014-5: as R1 on sheet Inputs; Mounting Technology: SM; Pins: 2; Case/Package: 0603; Min Operating Temperature: -55°C; RoHS Compliant: True; Max Operating Temperature: 155°C; Component Type: Resistors

## Nets that join several sheets
+3V3: Power (3V3_SUPPLY.2 C9.1 R9.1 U2.5), USB_HUB (7 pins)
+5: Power (15 pins), USB_HUB (12 pins)
+5_in: Inputs (5 pins), Power (C16.1 IC2.6)
+5V_P1: Power (IC3.1), Outputs (C37.1 D4.5 FB5.2 P1_PWR.2)
+5V_P2: Power (IC4.1), Outputs (C41.1 D5.5 FB7.2 P2_PWR.2)
+5V_P3: Power (IC5.1), Outputs (C45.1 D6.5 FB9.2 P3_PWR.2)
+5V_P4: Power (IC6.1), Outputs (C49.1 D7.5 FB11.2 P4_PWR.2)
ETH: Inputs (FB2.1), Outputs (FB6.1 FB8.1 FB10.1 FB12.1)
GND: Inputs (13 pins), Power (40 pins), USB_HUB (28 pins), Outputs (28 pins)
VCC_IN: Inputs (C6.1 FB3.2 R4.1), Power (6 pins)
*P1_FLT: Power (IC3.3), USB_HUB (IC7.4 R23.1 R35.2 U3.13)
*P2_FLT: Power (IC4.3), USB_HUB (IC7.6 R24.1 R36.2 U3.17)
*P3_FLT: Power (IC5.3), USB_HUB (IC7.12 R25.1 R37.2 U3.19)
*P4_FLT: Power (IC6.3), USB_HUB (IC7.14 R26.1 R38.2 U3.21)
BC_EN1: Power (IC3.4), USB_HUB (U3.12)
BC_EN2: Power (IC4.4), USB_HUB (U3.16)
BC_EN3: Power (IC5.4), USB_HUB (U3.18)
BC_EN4: Power (IC6.4), USB_HUB (U3.20)
D_O1_N: USB_HUB (U3.1), Outputs (D4.4)
D_O1_P: USB_HUB (U3.2), Outputs (D4.3)
D_O2_N: USB_HUB (U3.3), Outputs (D5.4)
D_O2_P: USB_HUB (U3.4), Outputs (D5.3)
D_O3_N: USB_HUB (U3.6), Outputs (D6.4)
D_O3_P: USB_HUB (U3.7), Outputs (D6.3)
D_O4_N: USB_HUB (U3.8), Outputs (D7.4)
D_O4_P: USB_HUB (U3.9), Outputs (D7.3)
D_up_N: Inputs (D1.4), USB_HUB (U3.30)
D_up_P: Inputs (D1.3), USB_HUB (U3.31)
VBus_det: Inputs (C4.1 R1.2 R2.1), Power (IC1.7 IC2.4 U2.3), USB_HUB (U3.27)